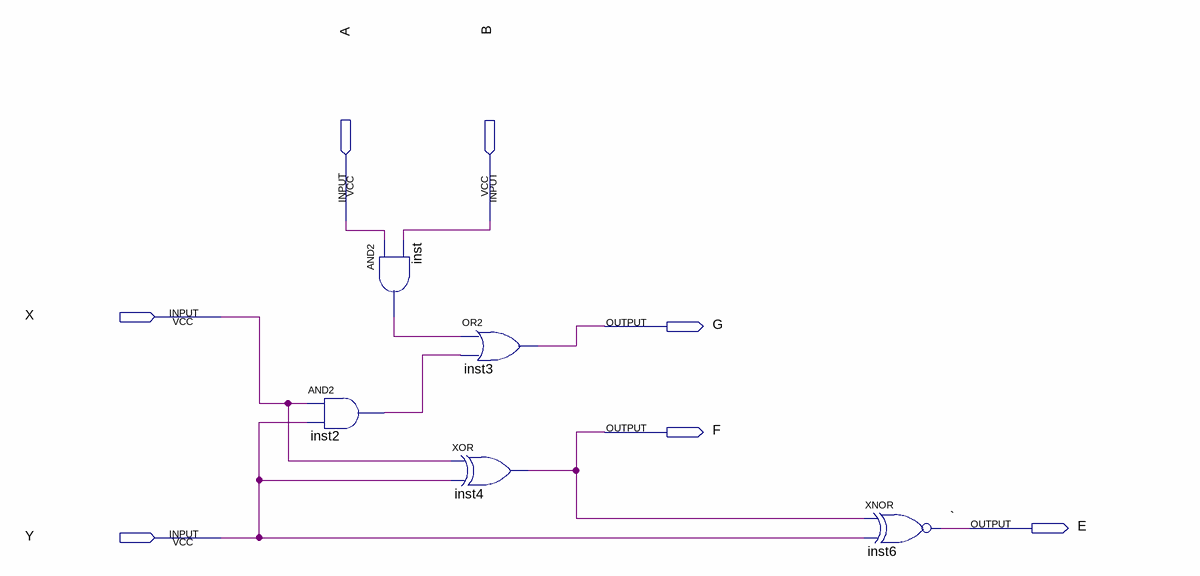
[diagram p0: schematic sheet]
// Quartus schematic Task2_GFE.bdf as structural Verilog: 5 symbols, 7 pins
module Task2_GFE (
  input  A,
  input  B,
  input  X,
  input  Y,
  output G,
  output F,
  output E
);

  wire inst2_out, inst_out;

  and inst (inst_out, A, B);
  and inst2 (inst2_out, X, Y);
  xor inst4 (F, X, Y);
  or inst3 (G, inst_out, inst2_out);
  xnor inst6 (E, F, Y);

  // Other names for the same wires on the sheet: ` = E
endmodule
